# EAGLE schematic io (EAGLE 6.6.0)
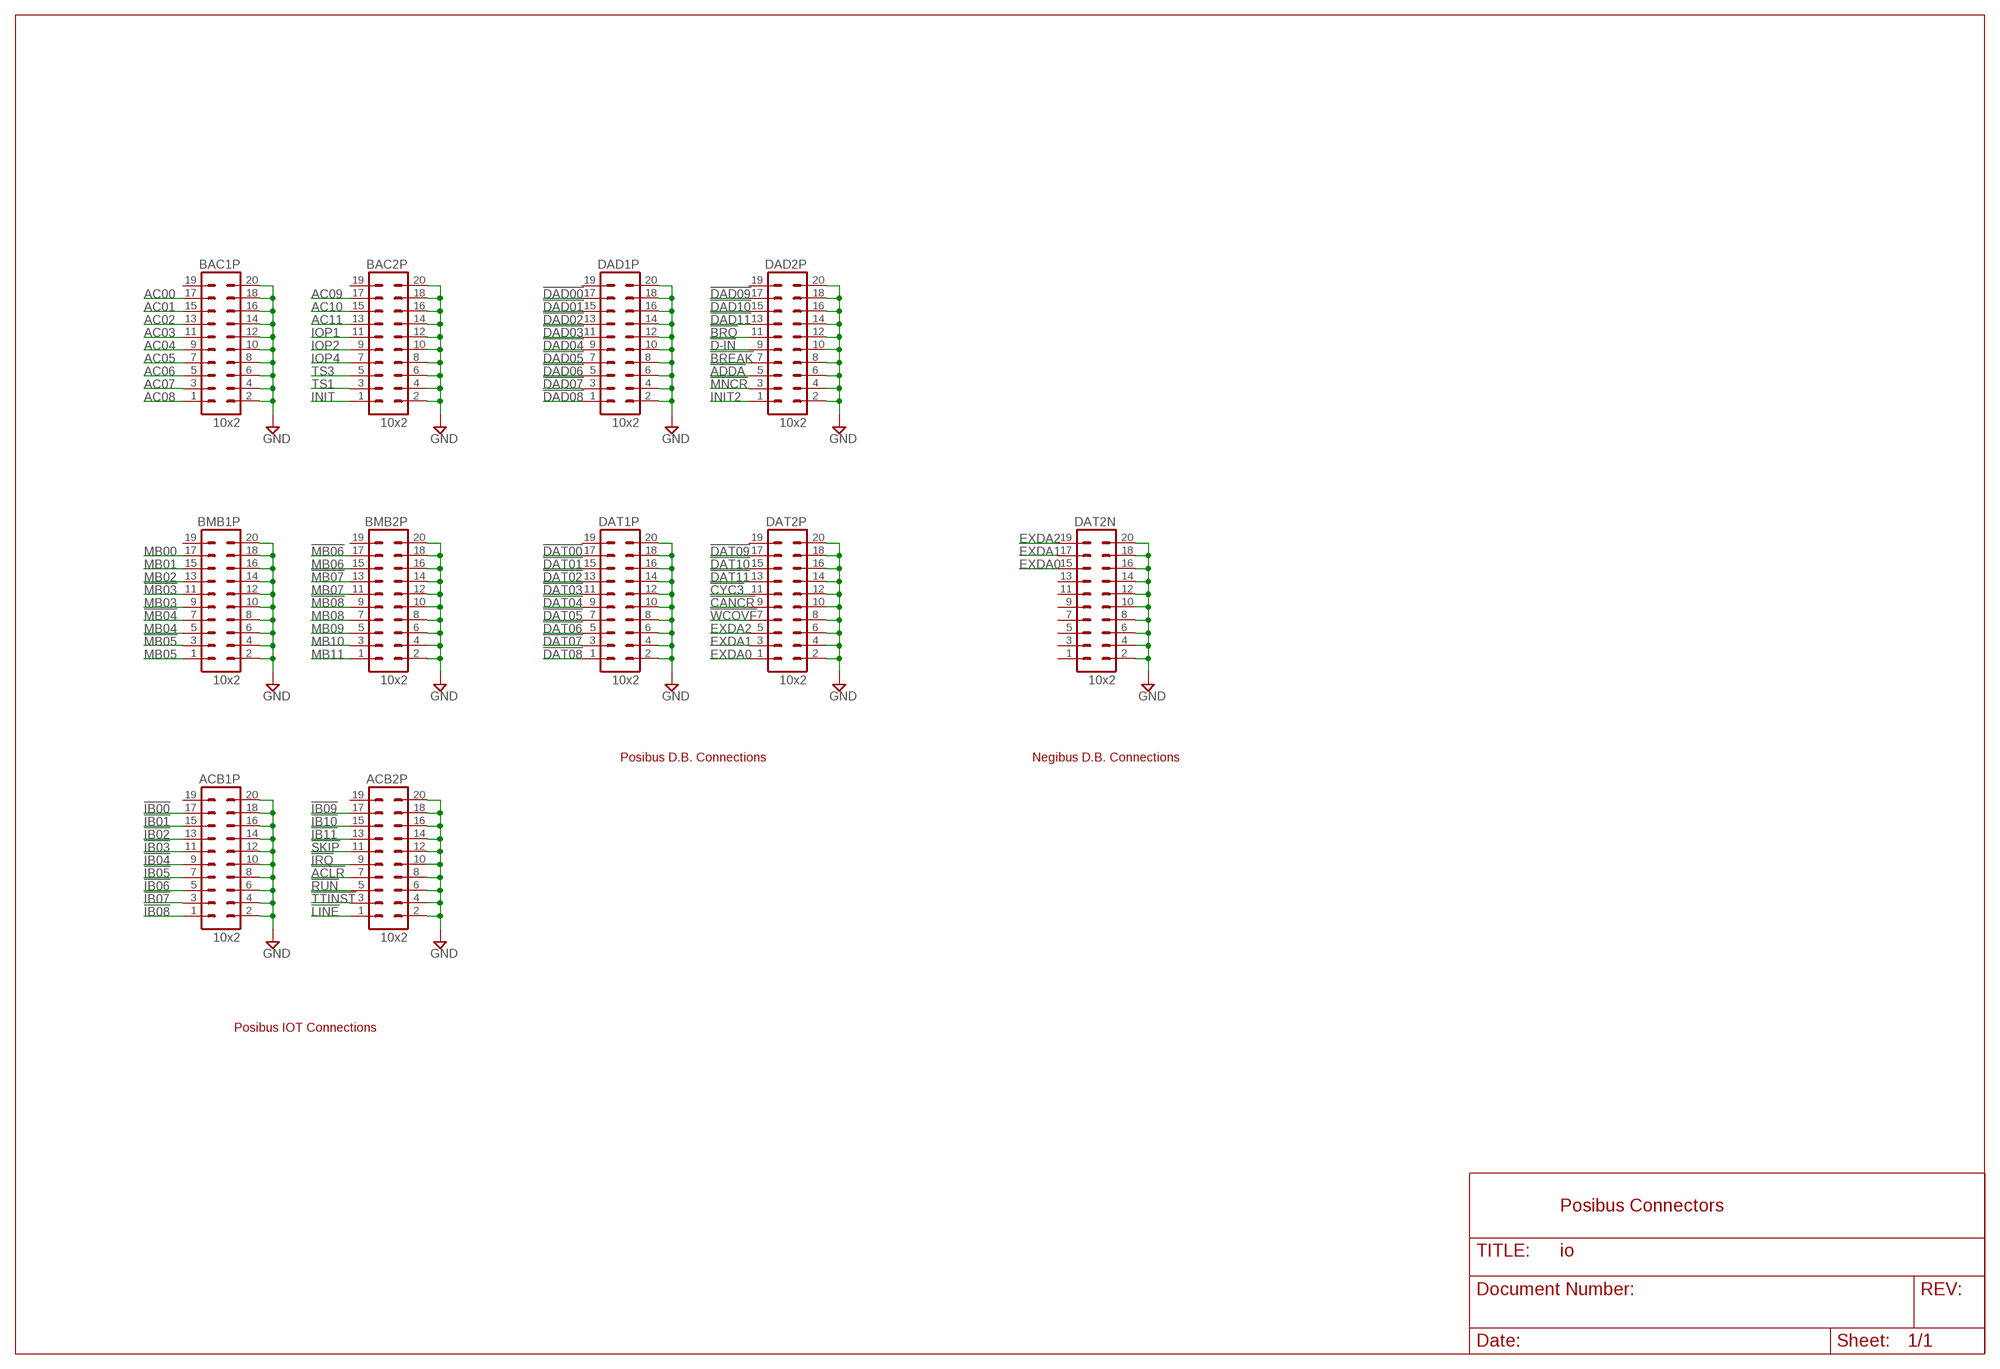
[diagram p0: schematic, sheet 1]

## Parts
ACB1P  10x2  MA10-2  [MA10-2]
ACB2P  10x2  MA10-2  [MA10-2]
BAC1P  10x2  MA10-2  [MA10-2]
BAC2P  10x2  MA10-2  [MA10-2]
BMB1P  10x2  MA10-2  [MA10-2]
BMB2P  10x2  MA10-2  [MA10-2]
DAD1P  10x2  MA10-2  [MA10-2]
DAD2P  10x2  MA10-2  [MA10-2]
DAT1P  10x2  MA10-2  [MA10-2]
DAT2N  10x2  MA10-2  [MA10-2]
DAT2P  10x2  MA10-2  [MA10-2]

## Nets
!ACLR: ACB2P.7
!ADDA: DAD2P.5
!BREAK: DAD2P.7
!BRQ: DAD2P.11
!CANCR: DAT2P.9
!CYC3: DAT2P.11
!D-IN: DAD2P.9
!DAD00: DAD1P.17
!DAD01: DAD1P.15
!DAD02: DAD1P.13
!DAD03: DAD1P.11
!DAD04: DAD1P.9
!DAD05: DAD1P.7
!DAD06: DAD1P.5
!DAD07: DAD1P.3
!DAD08: DAD1P.1
!DAD09: DAD2P.17
!DAD10: DAD2P.15
!DAD11: DAD2P.13
!DAT00: DAT1P.17
!DAT01: DAT1P.15
!DAT02: DAT1P.13
!DAT03: DAT1P.11
!DAT04: DAT1P.9
!DAT05: DAT1P.7
!DAT06: DAT1P.5
!DAT07: DAT1P.3
!DAT08: DAT1P.1
!DAT09: DAT2P.17
!DAT10: DAT2P.15
!DAT11: DAT2P.13
!IB00: ACB1P.17
!IB01: ACB1P.15
!IB02: ACB1P.13
!IB03: ACB1P.11
!IB04: ACB1P.9
!IB05: ACB1P.7
!IB06: ACB1P.5
!IB07: ACB1P.3
!IB08: ACB1P.1
!IB09: ACB2P.17
!IB10: ACB2P.15
!IB11: ACB2P.13
!IRQ: ACB2P.9
!LINE: ACB2P.1
!MB03: BMB1P.11
!MB04: BMB1P.7
!MB05: BMB1P.3
!MB06: BMB2P.17
!MB07: BMB2P.13
!MB08: BMB2P.9
!MNCR: DAD2P.3
!RUN: ACB2P.5
!SKIP: ACB2P.11
!TTINST: ACB2P.3
!WCOVF: DAT2P.7
AC00: BAC1P.17
AC01: BAC1P.15
AC02: BAC1P.13
AC03: BAC1P.11
AC04: BAC1P.9
AC05: BAC1P.7
AC06: BAC1P.5
AC07: BAC1P.3
AC08: BAC1P.1
AC09: BAC2P.17
AC10: BAC2P.15
AC11: BAC2P.13
EXDA0: DAT2N.15 DAT2P.1
EXDA1: DAT2N.17 DAT2P.3
EXDA2: DAT2N.19 DAT2P.5
GND [supply]: ACB1P.2 ACB1P.4 ACB1P.6 ACB1P.8 ACB1P.10 ACB1P.12 ACB1P.14 ACB1P.16 ACB1P.18 ACB1P.20 ACB2P.2 ACB2P.4 ACB2P.6 ACB2P.8 ACB2P.10 ACB2P.12 ACB2P.14 ACB2P.16 ACB2P.18 ACB2P.20 BAC1P.2 BAC1P.4 BAC1P.6 BAC1P.8 BAC1P.10 BAC1P.12 BAC1P.14 BAC1P.16 BAC1P.18 BAC1P.20 BAC2P.2 BAC2P.4 BAC2P.6 BAC2P.8 BAC2P.10 BAC2P.12 BAC2P.14 BAC2P.16 BAC2P.18 BAC2P.20 BMB1P.2 BMB1P.4 BMB1P.6 BMB1P.8 BMB1P.10 BMB1P.12 BMB1P.14 BMB1P.16 BMB1P.18 BMB1P.20 BMB2P.2 BMB2P.4 BMB2P.6 BMB2P.8 BMB2P.10 BMB2P.12 BMB2P.14 BMB2P.16 BMB2P.18 BMB2P.20 DAD1P.2 DAD1P.4 DAD1P.6 DAD1P.8 DAD1P.10 DAD1P.12 DAD1P.14 DAD1P.16 DAD1P.18 DAD1P.20 DAD2P.2 DAD2P.4 DAD2P.6 DAD2P.8 DAD2P.10 DAD2P.12 DAD2P.14 DAD2P.16 DAD2P.18 DAD2P.20 DAT1P.2 DAT1P.4 DAT1P.6 DAT1P.8 DAT1P.10 DAT1P.12 DAT1P.14 DAT1P.16 DAT1P.18 DAT1P.20 DAT2N.2 DAT2N.4 DAT2N.6 DAT2N.8 DAT2N.10 DAT2N.12 DAT2N.14 DAT2N.16 DAT2N.18 DAT2N.20 DAT2P.2 DAT2P.4 DAT2P.6 DAT2P.8 DAT2P.10 DAT2P.12 DAT2P.14 DAT2P.16 DAT2P.18 DAT2P.20
INIT: BAC2P.1
INIT2: DAD2P.1
IOP1: BAC2P.11
IOP2: BAC2P.9
IOP4: BAC2P.7
MB00: BMB1P.17
MB01: BMB1P.15
MB02: BMB1P.13
MB03: BMB1P.9
MB04: BMB1P.5
MB05: BMB1P.1
MB06: BMB2P.15
MB07: BMB2P.11
MB08: BMB2P.7
MB09: BMB2P.5
MB10: BMB2P.3
MB11: BMB2P.1
TS1: BAC2P.3
TS3: BAC2P.5
Unconnected: ACB1P.19 ACB2P.19 BAC1P.19 BAC2P.19 BMB1P.19 BMB2P.19 DAD1P.19 DAD2P.19 DAT1P.19 DAT2N.1 DAT2N.3 DAT2N.5 DAT2N.7 DAT2N.9 DAT2N.11 DAT2N.13 DAT2P.19

## Notes on the sheet
- Posibus D.B. Connections | Negibus D.B. Connections
- Posibus IOT Connections
- Posibus Connectors

## Library data of the parts
ACB1P ACB2P BAC1P BAC2P BMB1P BMB2P DAD1P DAD2P DAT1P DAT2N DAT2P = con-lstb:MA10-2: PIN HEADER; OC_FARNELL: unknown; OC_NEWARK: unknown

## Net classes
1 supply: width 0.711 mm